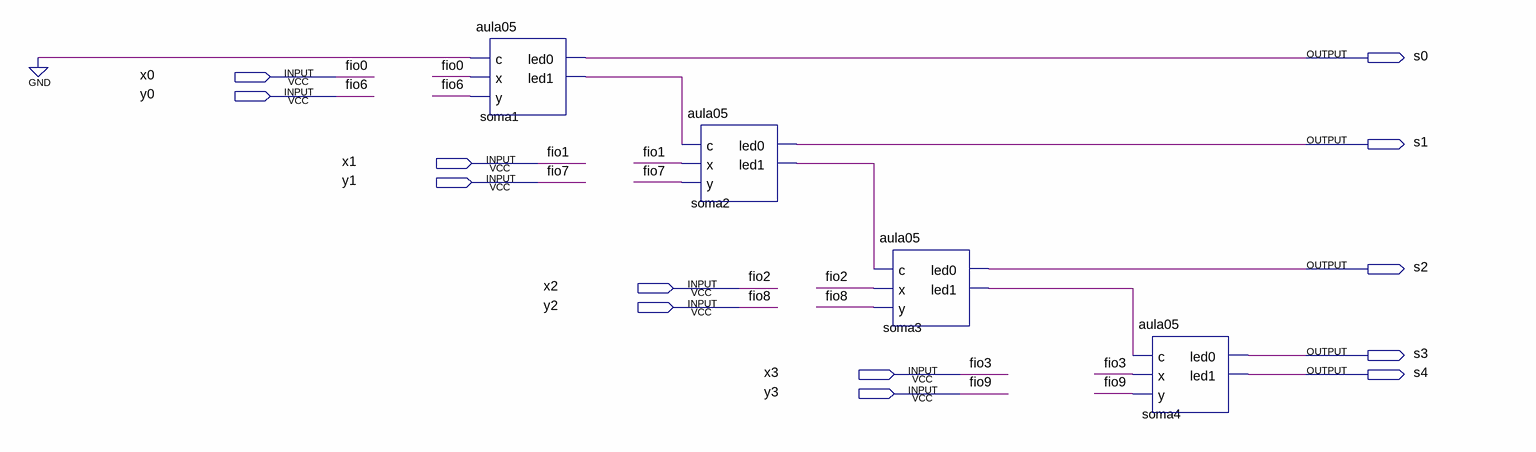
[diagram p0: schematic sheet]
// Quartus schematic aula06.bdf as structural Verilog: 4 symbols, 13 pins
module aula06 (
  input  x0,
  input  y0,
  input  x1,
  input  y1,
  input  x2,
  input  y2,
  input  x3,
  input  y3,
  output s0,
  output s1,
  output s2,
  output s3,
  output s4
);

  wire soma1_led1, soma2_led1, soma3_led1;

  aula05 soma1 (.c(1'b0), .x(x0), .y(y0), .led0(s0), .led1(soma1_led1));
  aula05 soma2 (.c(soma1_led1), .x(x1), .y(y1), .led0(s1), .led1(soma2_led1));
  aula05 soma3 (.c(soma2_led1), .x(x2), .y(y2), .led0(s2), .led1(soma3_led1));
  aula05 soma4 (.c(soma3_led1), .x(x3), .y(y3), .led0(s3), .led1(s4));

  // Other names for the same wires on the sheet: fio0 = x0; fio1 = x1; fio2 = x2; fio3 = x3; fio6 = y0; fio7 = y1;
  //   fio8 = y2; fio9 = y3
endmodule
